# EAGLE board electrosteel2020_10_arrange6_synthboardsonly3 (EAGLE 9.6.2)
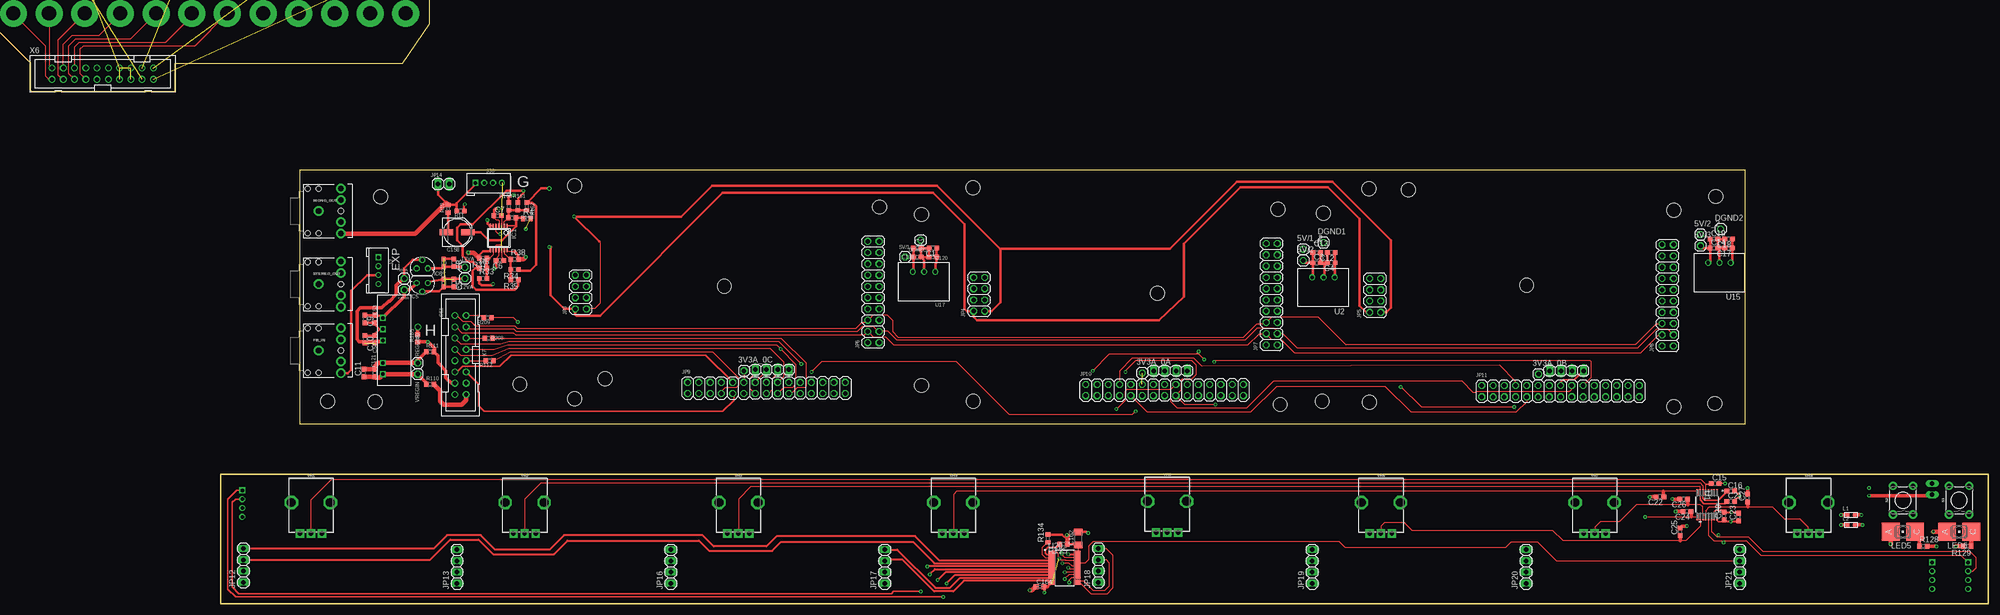
[diagram p2: board, top side]
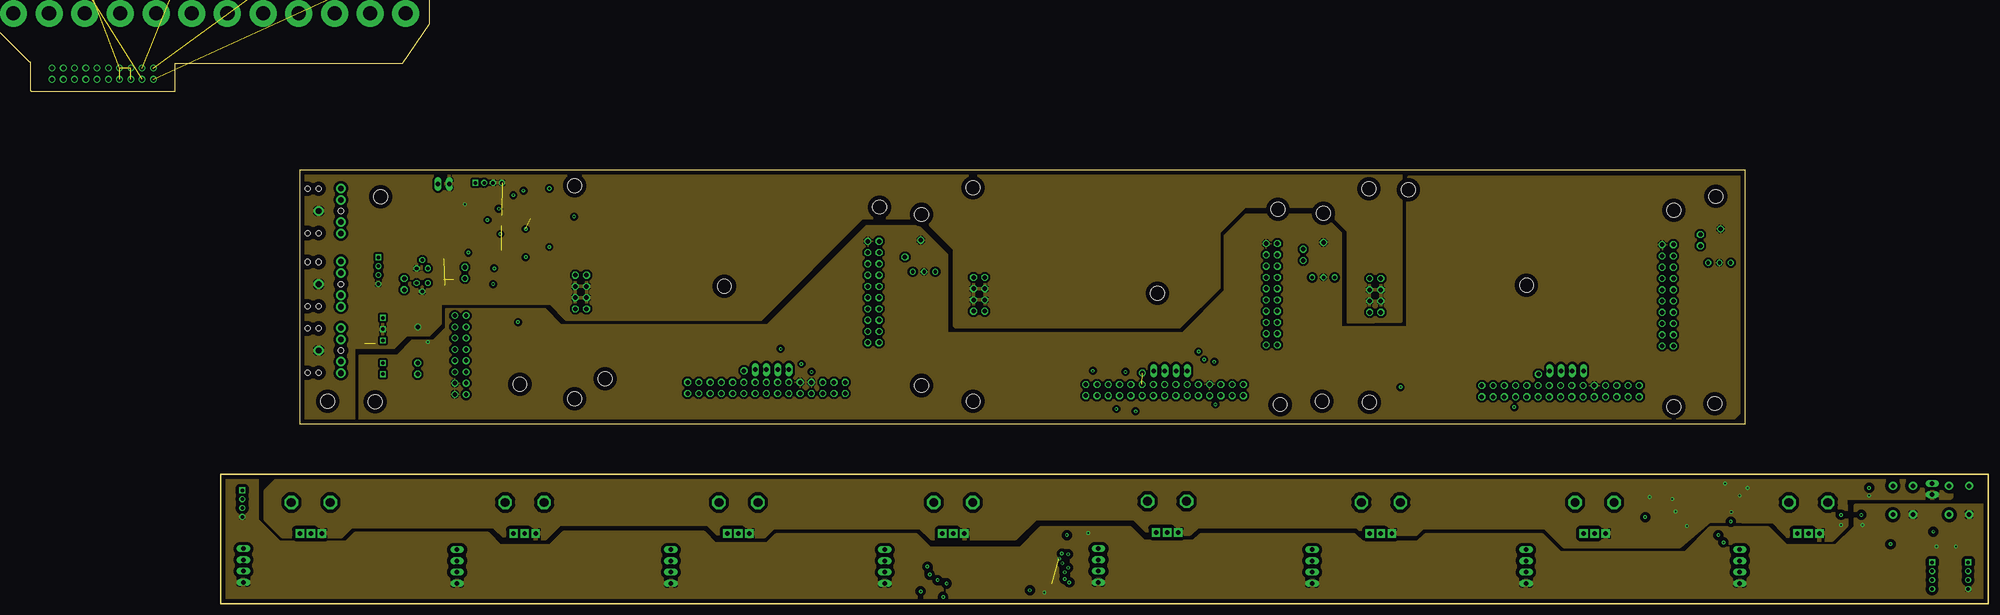
[diagram p3: board, inner layer Route2]
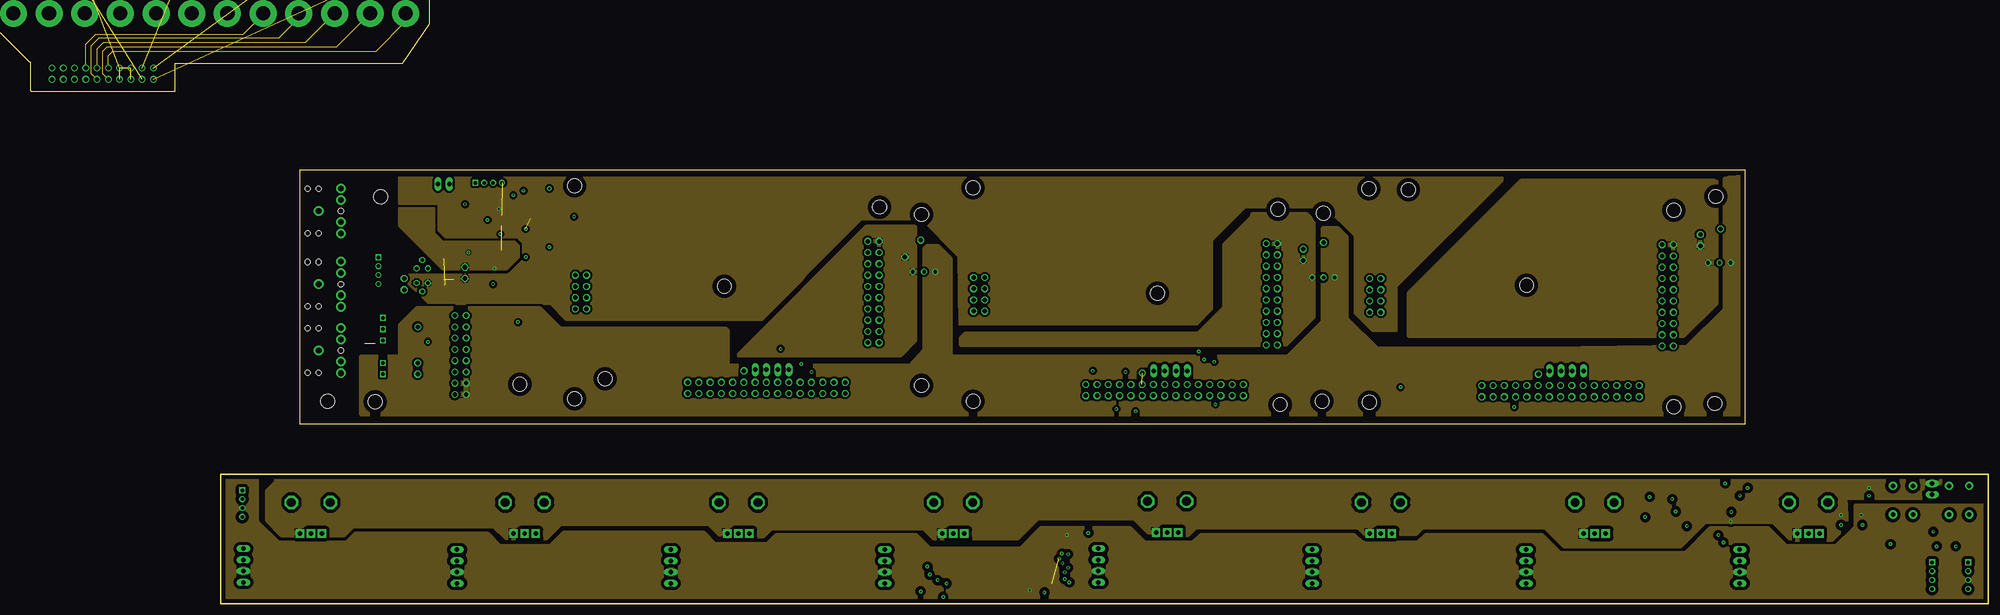
[diagram p4: board, inner layer Route15]
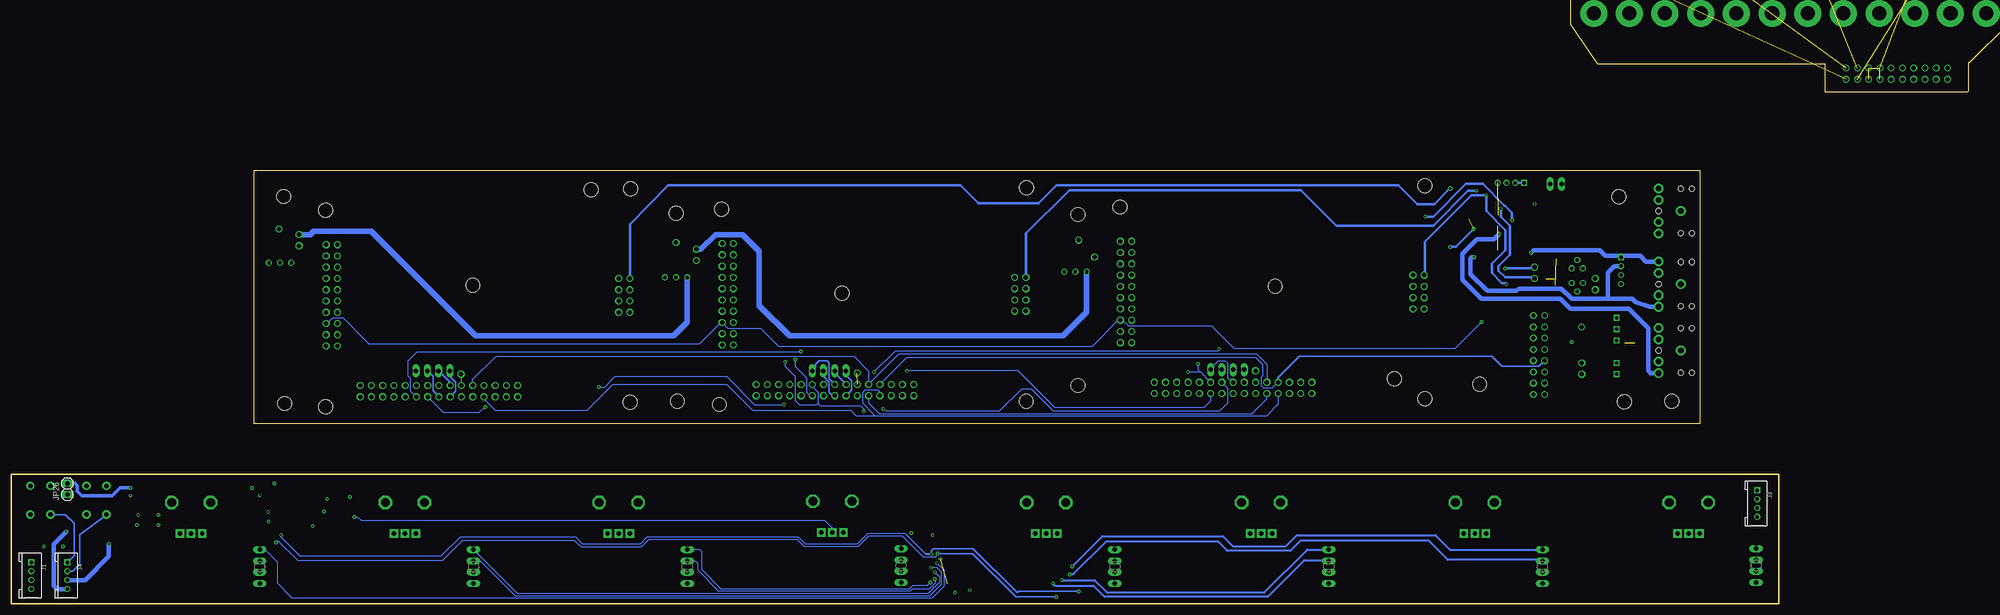
[diagram p5: board, bottom side, seen from below]

Size 399.03 x 97.79 mm. Coordinates in mm from the lower left corner, seen from the top.
Outline: 17.78,97.79 17.78,40.64 344.17,40.64 344.17,97.79 17.78,97.79
Outline: 0,0 0,29.21 399.03,29.21 399.03,0 0,0
Copper layers (1+2*15+16): Top 0.035mm / dielectric 0.5mm / Route2 0.035mm / dielectric 0.5mm / Route15 0.035mm / dielectric 0.5mm / Bottom 0.035mm
Design rules "default *": minimum track width 6mil, minimum drill 0.35mm, track to track 9mil, track to pad 9mil, pad to pad 9mil, via to via 9mil, smd to smd 9mil, copper to edge 40mil, drill to drill 6mil, minimum pad ring 10mil, minimum via ring 8mil, stop-mask expansion 4mil, vias tented up to drill 0mil, thermal gap 10mil
Holes 3.17 mm at 79.88,94.36 148.72,89.53 79.88,46.23 169.8,93.85 238.63,89.03 169.85,45.69 259.21,93.62 328.02,88.8 259.28,45.44 113.66,71.63 211.46,70.1 294.77,71.88 36.07,91.82 328.04,44.45 268.1,93.47 86.74,50.8 239.14,44.96 34.8,45.59 248.62,45.69 337.26,45.19 337.52,91.92 248.87,88.11 158.19,87.86 24.08,45.69 158.19,49.25 67.51,49.5
Milling: 15 lines

## Footprints (pad centres in the part's own frame; a part is rotated, then mirrored left to right if it is on the bottom)
1X01 = drill 1.016 octagon: 1 0,0
C0603 = smd 1.1 x 1: 1 -0.85,0; 2 0.85,0
PANASONIC_D = smd 3 x 1.4: + 2.4,0; - -2.4,0
C1206K = smd 1.5 x 2: 1 -1.5,0; 2 1.5,0
C0603K = smd 1.05 x 1.08: 1 -0.875,0; 2 0.875,0
AUDIO-JACK-KIT = drill 1.3 pad 2.184: RING 5,5.1; RSH 5,2.5; SLEEVE 0,0; TIP 5,-5.1; TSH 5,-2.5 | hole 1.2: 0,5; -2.5,5; -2.5,-5; 0,-5; 5,0
TSSOP14 = smd 0.305 x 0.991: 1 -1.905,-2.718; 2 -1.27,-2.718; 3 -0.635,-2.718; 4 0,-2.718; 5 0.635,-2.718; 6 1.27,-2.718; 7 1.905,-2.718; 8 1.905,2.718; 9 1.27,2.718; 10 0.635,2.718; 11 0,2.718; 12 -0.635,2.718; 13 -1.27,2.718; 14 -1.905,2.718
78LXX = drill 0.813 octagon: GND 0,1.905; IN 1.27,0; OUT -1.27,0
79LXX = drill 0.813 octagon: GND -1.27,0; IN 0,1.905; OUT 1.27,0
HW4-2.0 = drill 0.8 pad 1.27 square: 1 -3,0 | drill 0.8 pad 1.27: 2 -1,0; 3 1,0; 4 3,0
1X04 = drill 1.016 long: 1 -3.81,0; 2 -1.27,0; 3 1.27,0; 4 3.81,0
2X04 = drill 1.016 octagon: 1 -3.81,-1.27; 2 -3.81,1.27; 3 -1.27,-1.27; 4 -1.27,1.27; 5 1.27,-1.27; 6 1.27,1.27; 7 3.81,-1.27; 8 3.81,1.27
2X10 = drill 1.016 octagon: 1 -11.43,-1.27; 2 -11.43,1.27; 3 -8.89,-1.27; 4 -8.89,1.27; 5 -6.35,-1.27; 6 -6.35,1.27; 7 -3.81,-1.27; 8 -3.81,1.27; 9 -1.27,-1.27; 10 -1.27,1.27; 11 1.27,-1.27; 12 1.27,1.27; 13 3.81,-1.27; 14 3.81,1.27; 15 6.35,-1.27; 16 6.35,1.27; 17 8.89,-1.27; 18 8.89,1.27; 19 11.43,-1.27; 20 11.43,1.27
2X15 = drill 1.016 octagon: 1 -17.78,-1.27; 2 -17.78,1.27; 3 -15.24,-1.27; 4 -15.24,1.27; 5 -12.7,-1.27; 6 -12.7,1.27; 7 -10.16,-1.27; 8 -10.16,1.27; 9 -7.62,-1.27; 10 -7.62,1.27; 11 -5.08,-1.27; 12 -5.08,1.27; 13 -2.54,-1.27; 14 -2.54,1.27; 15 0,-1.27; 16 0,1.27; 17 2.54,-1.27; 18 2.54,1.27; 19 5.08,-1.27; 20 5.08,1.27; 21 7.62,-1.27; 22 7.62,1.27; 23 10.16,-1.27; 24 10.16,1.27; 25 12.7,-1.27; 26 12.7,1.27; 27 15.24,-1.27; 28 15.24,1.27; 29 17.78,-1.27; 30 17.78,1.27
1X02 = drill 1.016 long: 1 -1.27,0; 2 1.27,0
INDUCTOR_L0603 = smd 0.889 x 0.889: 1 -0.762,0; 2 0.762,0
P-LCC-2 = smd 4 x 4: A 0,2.75; C 0,-2.75
R0603 = smd 1 x 1.1: 1 -0.85,0; 2 0.85,0
TACTILE_SWITCH_PTH_6.0MM = drill 1.016 pad 1.88: 1 -3.251,2.261; 2 3.251,2.261; 3 -3.251,-2.261; 4 3.251,-2.261
21-0055H_16_MXM = smd 1.46 x 0.356: 1 -2.724,2.223; 2 -2.724,1.587; 3 -2.724,0.953; 4 -2.724,0.318; 5 -2.724,-0.318; 6 -2.724,-0.953; 7 -2.724,-1.587; 8 -2.724,-2.223; 9 2.724,-2.223; 10 2.724,-1.587; 11 2.724,-0.953; 12 2.724,-0.318; 13 2.724,0.318; 14 2.724,0.953; 15 2.724,1.587; 16 2.724,2.223
DC-DC_CONVERTER_78XX = drill 0.8: GND 0,0; VIN -2.54,0; VOUT 2.54,0
SOP65P640X120-24N = smd 1.57 x 0.41: 1 -2.87,3.575; 2 -2.87,2.925; 3 -2.87,2.275; 4 -2.87,1.625; 5 -2.87,0.975; 6 -2.87,0.325; 7 -2.87,-0.325; 8 -2.87,-0.975; 9 -2.87,-1.625; 10 -2.87,-2.275; 11 -2.87,-2.925; 12 -2.87,-3.575; 13 2.87,-3.575; 14 2.87,-2.925; 15 2.87,-2.275; 16 2.87,-1.625; 17 2.87,-0.975; 18 2.87,-0.325; 19 2.87,0.325; 20 2.87,0.975; 21 2.87,1.625; 22 2.87,2.275; 23 2.87,2.925; 24 2.87,3.575
CMR0512S3C = drill 0.8 square: P$1 -7.62,0; P$2 -5.08,0; P$3 0,0; P$4 2.54,0; P$5 5.08,0
POT-PTH-ALPS = drill 1 pad 1.88 square: P$1 7,-2.5; P$2 7,0; P$3 7,2.5 | drill 2 octagon: P$4 0,-4.4; P$5 0,4.4
PAK100/2500-20 = drill 1 pad 1.422: 1 -11.43,-1.27; 2 -11.43,1.27; 3 -8.89,-1.27; 4 -8.89,1.27; 5 -6.35,-1.27; 6 -6.35,1.27; 7 -3.81,-1.27; 8 -3.81,1.27; 9 -1.27,-1.27; 10 -1.27,1.27; 11 1.27,-1.27; 12 1.27,1.27; 13 3.81,-1.27; 14 3.81,1.27; 15 6.35,-1.27; 16 6.35,1.27; 17 8.89,-1.27; 18 8.89,1.27; 19 11.43,-1.27; 20 11.43,1.27
PAK100/2500-16 = drill 1 pad 1.422: 1 -8.89,-1.27; 2 -8.89,1.27; 3 -6.35,-1.27; 4 -6.35,1.27; 5 -3.81,-1.27; 6 -3.81,1.27; 7 -1.27,-1.27; 8 -1.27,1.27; 9 1.27,-1.27; 10 1.27,1.27; 11 3.81,-1.27; 12 3.81,1.27; 13 6.35,-1.27; 14 6.35,1.27; 15 8.89,-1.27; 16 8.89,1.27

## Placement (x,y rotation side)
3V3A_0A  PINHD-1X1  [1X01]  208.03,52.07 0 top
3V3A_0B  PINHD-1X1  [1X01]  297.43,51.82 0 top
3V3A_0C  PINHD-1X1  [1X01]  118.11,52.58 0 top
5V/1  PINHD-1X1  [1X01]  154.43,78.23 0 top
5V/1_2  PINHD-1X1  [1X01]  244.35,80.01 0 top
5V/2  PINHD-1X1  [1X01]  244.35,77.47 0 top
5V/2_2  PINHD-1X1  [1X01]  334.01,83.31 0 top
5V/3  PINHD-1X1  [1X01]  334.01,80.77 0 top
+12VA  PINHD-1X1  [1X01]  55.12,73.41 0 top
+15VA  PINHD-1X1  [1X01]  41.4,70.87 180 top
-12VA  PINHD-1X1  [1X01]  55.12,75.95 180 top
-15VA  PINHD-1X1  [1X01]  41.4,73.41 180 top
C1  .1uf  [C0603]  160.78,80.26 180 top
C2  .1uf  [C0603]  157.23,80.26 0 top
C3  .01uf  [C0603]  247.4,76.96 0 top
C4  .01uf  [C0603]  250.7,76.96 180 top
C5  .1uf  [C0603]  52.58,72.39 270 top
C6  .1uf  [C0603]  62.99,77.47 180 top
C7  .1uf  [C0603]  62.48,87.63 0 top
C8  .1uf  [C0603]  52.58,76.96 270 top
C9  .1uf  [C0603]  32.51,64.26 270 top
C10  .1uf  [C0603]  32.51,59.69 270 top
C11  .1uf  [C0603]  32.26,52.07 90 top
C12  .1uf  [C0603]  250.7,79.25 180 top
C13  .1uf  [C0603]  247.4,79.25 0 top
C14  .01uf  [C0603]  337.06,80.26 0 top
C15  .01uf  [C0603]  337.31,27.18 0 top
C16  .01uf  [C0603]  340.87,25.4 0 top
C17  .01uf  [C0603]  340.36,80.26 180 top
C18  .1uf  [C0603]  340.36,82.3 180 top
C19  .1uf  [C0603]  337.06,82.3 0 top
C20  .01uf  [C0603]  339.34,19.81 90 top
C21  .01uf  [C0603]  340.87,23.11 0 top
C22  .01uf  [C0603]  324.87,24.13 180 top
C23  .1uf  [C0603]  342.65,19.56 90 top
C24  .01uf  [C0603]  330.96,20.83 180 top
C25  .01uf  [C0603]  329.44,16.26 90 top
C26  .01uf  [C0603]  330.2,23.62 180 top
C27  .01uf  [C0603]  344.68,23.88 90 top
C51  .01uf  [C0603]  50.29,72.39 270 top
C52  .01uf  [C0603]  50.29,76.96 270 top
C53  .01uf  [C0603]  34.8,64.26 270 top
C54  .01uf  [C0603]  34.8,59.69 270 top
C119  .01uf  [C0603]  157.23,78.23 0 top
C120  .01uf  [C0603]  160.73,78.26 180 top
C121  .01uf  [C0603]  34.8,52.07 90 top
C158  22uf  [PANASONIC_D]  53.34,83.82 0 top
C162  1uf  [C1206K]  193.55,14.73 90 top
C164  .1uf  [C0603K]  184.91,3.81 0 top
DGND1  PINHD-1X1  [1X01]  248.92,81.53 0 top
DGND2  PINHD-1X1  [1X01]  338.58,84.58 0 top
DGND5  PINHD-1X1  [1X01]  157.99,82.04 180 top
FB_IN  AUDIO_JACK_3.5MM_KIT  [AUDIO-JACK-KIT]  22.1,57.15 0 top
IC1  OPA4344E  [TSSOP14]  62.74,82.55 180 top
IC5  [78LXX]  45.47,72.39 180 top
IC6  [79LXX]  45.47,75.69 0 top
J1  4P-2.0  [HW4-2.0]  394.46,6.35 270 bottom
J2  4P-2.0  [HW4-2.0]  35.56,75.18 270 top
J3  4P-2.0  [HW4-2.0]  4.83,22.61 270 bottom
J4  4P-2.0  [HW4-2.0]  386.33,6.35 270 bottom
J36  4P-2.0  [HW4-2.0]  60.45,95 0 top
JP1  PINHD-1X4  [1X04]  124.46,52.83 180 top
JP2  PINHD-1X4  [1X04]  214.38,52.58 180 top
JP3  PINHD-2X4  [2X04]  81.28,70.36 90 top
JP4  PINHD-2X4  [2X04]  171.2,69.85 90 top
JP5  PINHD-2X4  [2X04]  260.6,69.6 90 top
JP6  PINHD-2X10  [2X10]  147.32,70.36 90 top
JP7  PINHD-2X10  [2X10]  237.24,69.85 90 top
JP8  PINHD-2X10  [2X10]  326.64,69.6 90 top
JP9  [2X15]  123.16,48.72 0 top
JP10  [2X15]  213.06,48.23 0 top
JP11  [2X15]  302.44,47.98 0 top
JP12  PINHD-1X4  [1X04]  5.08,8.64 90 top
JP13  PINHD-1X4  [1X04]  53.34,8.38 90 top
JP14  PINHD-1X2  [1X02]  50.29,94.74 0 top
JP15  PINHD-1X4  [1X04]  303.78,52.58 180 top
JP16  PINHD-1X4  [1X04]  101.6,8.38 90 top
JP17  PINHD-1X4  [1X04]  149.86,8.38 90 top
JP18  PINHD-1X4  [1X04]  198.12,8.64 90 top
JP19  PINHD-1X4  [1X04]  246.38,8.38 90 top
JP20  PINHD-1X4  [1X04]  294.64,8.38 90 top
JP21  PINHD-1X4  [1X04]  342.9,8.38 90 top
JP22  PINHD-1X2  [1X02]  -30.73,140.46 90 top  (outside the outline)
JP23  PINHD-1X2  [1X02]  -10.41,140.46 90 top  (outside the outline)
JP24  PINHD-1X2  [1X02]  29.97,140.46 90 top  (outside the outline)
JP25  PINHD-1X2  [1X02]  9.65,140.46 90 top  (outside the outline)
JP26  PINHD-1X2  [1X02]  386.33,25.91 90 bottom
L1  [INDUCTOR_L0603]  368.05,20.07 0 top
L2  [INDUCTOR_L0603]  368.05,17.78 0 top
LED5  GREEN  [P-LCC-2]  379.73,16.26 90 top
LED6  RED  [P-LCC-2]  392.43,16.26 90 top
MONO_OUT  AUDIO_JACK_3.5MM_KIT  [AUDIO-JACK-KIT]  22.1,88.65 0 top
R4  0R  [R0603]  69.09,86.87 0 top
R5  7.2k  [R0603]  59.18,75.69 0 top
R10  560R  [R0603]  51.31,89.15 90 top
R11  47k  [R0603]  54.1,88.65 180 top
R33  10k  [R0603]  59.18,73.41 0 top
R34  10k  [R0603]  66.29,75.44 180 top
R35  7.2k  [R0603]  66.29,73.15 180 top
R37  10k  [R0603]  59.18,77.98 180 top
R38  10k  [R0603]  66.29,77.72 0 top
R110  0R  [R0603]  47.24,49.53 0 top
R111  0R  [R0603]  47.24,56.9 0 top
R112  33R  [R0603]  60.71,54.86 180 top
R125  1k  [R0603]  190.25,13.46 180 top
R128  4.7k  [R0603]  384.3,12.95 0 top
R129  560R  [R0603]  394.21,12.95 180 top
R134  1k  [R0603]  186.69,14.73 90 top
R159  1k  [R0603]  65.79,87.12 0 top
R160  1k  [R0603]  65.02,89.66 270 top
R161  1k  [R0603]  67.06,89.66 270 top
R162  1k  [R0603]  69.09,89.66 270 top
R185  0R  [R0603]  44.45,59.94 90 top
R208  33R  [R0603]  60.45,59.94 180 top
R209  33R  [R0603]  60.2,64.52 180 top
S1  MOMENTARY-SWITCH-SPST-PTH-6.0MM  [TACTILE_SWITCH_PTH_6.0MM]  392.43,23.37 90 top
S2  MOMENTARY-SWITCH-SPST-PTH-6.0MM  [TACTILE_SWITCH_PTH_6.0MM]  379.73,23.37 90 top
STEREO_OUT  AUDIO_JACK_3.5MM_KIT  [AUDIO-JACK-KIT]  22.1,72.14 0 top
U1  MAX11615EEE+  [21-0055H_16_MXM]  335.53,22.35 270 top
U2  R-78E5.0-1.0  [DC-DC_CONVERTER_78XX]  248.92,73.66 180 top
U15  R-78E5.0-1.0  [DC-DC_CONVERTER_78XX]  338.33,76.96 180 top
U17  R-78E5.0-1.0  [DC-DC_CONVERTER_78XX]  158.75,74.93 180 top
U20  TCA9548APWR  [SOP65P640X120-24N]  190.5,8.13 0 top
U$3  CMR0512S3C  [CMR0512S3C]  36.58,59.44 90 top
VR1  10k  [POT-PTH-ALPS]  20.32,22.86 270 top
VR2  10k  [POT-PTH-ALPS]  68.58,22.86 270 top
VR3  10k  [POT-PTH-ALPS]  116.84,22.86 270 top
VR4  10k  [POT-PTH-ALPS]  165.35,22.86 270 top
VR5  10k  [POT-PTH-ALPS]  213.61,23.11 270 top
VR6  10k  [POT-PTH-ALPS]  261.87,22.86 270 top
VR7  10k  [POT-PTH-ALPS]  310.13,22.86 270 top
VR8  10k  [POT-PTH-ALPS]  358.39,22.86 270 top
VREGGND  PINHD-1X1  [1X01]  44.45,54.36 180 top
VREGIN  PINHD-1X1  [1X01]  44.45,51.82 180 top
X6  2520-  [PAK100/2500-20]  -26.67,119.63 0 top  (outside the outline)
X7  2516-  [PAK100/2500-16]  54.1,56.13 90 top

## Tracks (layer width: path | path; a pad name or v marks a point on that pad's centre or on a via)
3V3D3  (via drill 0.35)
  Top 0.254: C162.1 193.55,11.88 U20.24
  Top 0.508: C162.1 193.32,13.46 R125.1 191.1,14.39 189.9,15.58 R134.2
  Top 0.813: L1.2 v370.33,20.07
  Top 1.016: R125.1 191.1,15.41 v191.01,15.49 | C164.1 183.9,3.81 183.13,3.05 v182.63,3.05
  pour Route15 (isolate 0.762): 0.25,1.27 0.25,29.02 7.87,28.96 8.13,28.7 8.13,18.54 12.95,13.72 28.45,13.72 30.48,15.75 60.2,15.75 62.99,12.95 74.42,12.95 77.47,16 108.97,16 111.51,13.46 123.44,13.46 125.48,15.49 156.97,15.49 160.02,12.45 180.59,12.45 185.17,17.02 205.23,17.02 208.53,13.72 219.46,13.72 221.23,15.49 255.78,15.49 257.56,13.72 270.26,13.72 272.03,15.49 298.2,15.49 302.26,11.43 330.71,11.43 336.3,17.02 349.25,17.02 353.31,12.95 364.74,12.95 369.06,17.27 369.06,22.1 397.76,22.1 397.76,1.27
+3.3V  (via drill 0.35)
  Top 0.254: U1.16 337.76,18.87 338.08,18.54 | 342.48,18.54 C23.1
  Top 0.305: 338.08,18.54 v340.87,18.54
  Top 0.406: 342.48,18.54 v340.87,18.54 339.43,18.54 339.43,18.87 C20.1
  Top 0.813: L1.1 v365.76,20.07
  Bottom 0.813: JP26.2 384.56,27.18 384.05,26.67 384.05,25.4 383.03,24.38 376.17,24.38 374.4,26.16 v372.11,26.16
  pour Route15 (isolate 0.762): 14.22,29.72 12.45,27.94 12.45,27.43 10.41,25.4 10.41,18.8 13.72,15.49 27.69,15.49 29.72,17.53 61.72,17.53 64.52,14.73 73.41,14.73 76.71,18.03 110.24,18.03 113.03,15.24 122.43,15.24 124.21,17.02 158.75,17.02 161.04,14.73 179.83,14.73 184.4,19.3 206.25,19.3 210.06,15.49 218.19,15.49 219.96,17.27 256.79,17.27 258.32,15.75 269.75,15.75 271.27,17.27 298.96,17.27 303.28,12.95 329.44,12.95 335.03,18.54 350.52,18.54 354.58,14.48 363.73,14.48 367.03,17.78 366.78,23.88 390.4,23.88 390.65,24.13 390.65,29.21 367.03,29.21 14.73,29.21
+5V/1
  Top 0.61: U17.VOUT 156.38,75.1 C119.1 C2.1
  Bottom 1.27: 5V/1_2.1 243.33,80.01 240.03,83.31 233.93,83.31 230.12,79.5 230.12,67.31 223.27,60.45 161.54,60.45 156.21,65.79 U17.VOUT
  pour Route15 (isolate 0.508): 156.72,85.09 156.72,59.44 153.42,56.13 116.84,56.13 145.8,85.09
+5V/2
  Top 0.61: C3.1 244.86,76.96 5V/2.1 | C13.1 C3.1 | C3.1 246.55,73.83 U2.VOUT
  Bottom 1.27: 5V/2_2.1 331.47,83.31 330.71,84.07 317.75,84.07 294.13,60.45 249.43,60.45 246.38,63.5 U2.VOUT
  pour Route15 (isolate 0.508): 246.63,86.36 246.63,64.77 240.28,58.42 167.13,58.42 167.13,59.94 168.15,60.96 220.73,60.96 226.57,66.8 226.57,81.03 232.92,87.38 232.92,87.88 245.11,87.88
+5V/3
  Top 0.61: C19.1 C14.1 | C14.1 336.21,77.38 U15.VOUT | C14.1 334.52,80.26 5V/3.1
  pour Route15 (isolate 0.508): 337.57,95.25 337.57,67.82 330.2,60.45 268.22,60.45 268.22,70.1 293.62,95.5 337.06,95.5 337.31,95.25
+9V  (via drill 0.35)  (1 unrouted)
  Top 0.254: C51.1 50.29,73.41 | 61.65,87.07 62.1,86.61 62.61,86.61 62.78,86.44 62.78,85.31 IC1.4
  Top 0.61: IC5.OUT 46.99,72.64 49.7,73.15 C51.1 | +12VA.1 50.29,73.41 | 61.65,87.07 61.63,87.08 C7.1 61.72,87.72 61.72,88.9 61.98,89.15 v62.74,89.15
  Bottom 0.61: +12VA.1 55.37,73.66 61.72,73.66 63.25,75.18 63.25,76.2 60.71,78.74 60.71,85.34 62.74,87.38 v62.74,89.15
  pour Route15 (isolate 0.508, rank 2): 40.13,74.42 64.77,74.42 68.07,77.72 68.07,81.03 66.55,82.55 50.55,82.55 49.02,84.07 49.02,90.17 40.13,90.17 40.13,96.27 289.39,96.27 289.39,95.5 265.51,71.63 265.51,61.47 259.93,61.47 255.86,65.53 255.86,83.06 249.51,89.41 231.22,89.41 223.86,82.04 223.86,66.55 220.3,62.99 166.62,62.82 166.43,78.43 158.24,86.61 144.53,86.61 141.48,83.57 132.2,74.42 131.06,72.9 122.17,64.01 77.98,64.01 74.42,67.56 46.99,67.56
+12V
  Top 0.61: U17.VIN 161.29,76.71 161.58,77 C120.1 161.58,80.21 C1.1 | C18.1 C17.1 341.21,77.3 U15.VIN | U2.VIN 251.55,73.75 C4.1 C12.1
  Top 1.016: R110.2 49.53,48.09 49.53,45.72 50.29,44.96 54.36,44.96 55.37,45.97 X7.1
  pour Route15 (isolate 0.508): 342.9,42.93 31.75,42.93 31.75,55.63 40.64,55.63 40.64,62.74 44.45,66.55 71.88,66.55 76.45,61.98 113.79,61.98 114.3,61.47 114.3,53.59 155.69,53.59 159,57.26 159,80.01 159.51,80.52 161.8,80.52 164.59,77.72 164.59,55.63 241.05,55.63 248.92,63.5 248.92,84.58 251.97,84.58 254,82.55 254,64.26 260.86,57.4 298.96,57.4 331.22,57.91 339.6,66.29 339.6,95.76 340.61,96.01 342.39,96.01 343.15,96.77 343.15,43.18
-9V  (via drill 0.35)
  Top 0.254: IC1.11 62.74,78.49 62.14,77.89 C6.2
  Top 0.61: -12VA.1 54.95,76.11 C8.2 C52.2 49.87,75.69 IC6.OUT | C6.2 62.14,75.86 61.98,75.69 v61.72,75.69
  Bottom 0.61: v61.72,75.69 55.37,75.69 -12VA.1
  pour Route15 (isolate 0.254): 48.26,89.41 40.13,89.41 40.13,85.34 50.04,75.44 64.52,75.44 67.31,78.23 67.31,80.77 66.29,81.79 50.04,81.79 48.26,83.57
A_IN  (via drill 0.35)  (1 unrouted)
  Top 0.508: v74.17,80.52 74.42,80.52 74.42,69.6 77.47,66.55 JP3.2 80.01,65.28 80.26,65.02 85.6,65.02 113.28,92.71 | JP4.2 169.93,64.77
  Top 0.61: JP4.2 168.4,66.04 167.89,66.55 167.89,85.6 160.78,92.71 113.28,92.71 | JP5.2 258.57,65.79 257.05,67.31 257.05,86.87 249.94,93.98 230.12,93.98 217.42,81.28 217.42,69.25 211.84,64.01 170.69,64.01 169.93,64.77
  Bottom 0.508: v74.17,80.52 72.9,80.52 v68.83,84.58
A_OUT1  (via drill 0.35)
  Top 0.254: 64.77,90.26 R160.1
  Top 0.406: 61.21,71.88 v61.47,72.14
  Top 0.61: R160.1 65.02,91.69 65.53,92.2 v66.04,92.2 | R33.1 58.33,72.39 58.84,71.88 61.21,71.88
  Bottom 0.406: 79.76,74.42 79.88,74.3 JP3.8
  Bottom 0.61: 79.88,74.3 79.88,81.66 69.34,92.2 v66.04,92.2 66.04,88.65 61.72,84.33 61.72,79.76 64.77,76.71 64.77,74.68 62.48,72.39 61.72,72.39 v61.47,72.14
A_OUT2  (via drill 0.35)
  Top 0.305: 58.17,75.95 58.17,75.69
  Top 0.406: v68.33,93.22 68.33,92.71 67.06,91.44 R161.1 | 58.17,75.69 R5.1
  Top 0.61: R35.1 67.14,71.72 66.29,70.87 57.66,70.87 56.9,71.63 56.9,75.18 57.4,75.69 58.17,75.69 | v68.33,93.22 64.52,93.22 56.9,85.6 54.1,85.6 53.34,84.84 53.34,82.04 54.61,80.77 54.61,78.49 55.88,77.22 56.9,77.22 58.17,75.95
  Bottom 0.61: JP4.8 169.93,83.57 160.13,93.36 107.84,93.36 99.82,85.34 77.98,85.34 70.1,93.22 v68.33,93.22
A_OUT3  (via drill 0.55)
  Top 0.406: 67.4,75.18 R34.1
  Top 0.61: v74.17,93.73 72.3,93.73 R162.1 70.27,90.51 71.12,89.66 71.12,76.45 69.85,75.18 67.4,75.18
  Bottom 0.61: v74.17,93.73 77.72,90.17 81.53,90.17 85.85,94.49 163.07,94.49 167.13,90.42 180.59,90.42 184.66,94.49 250.7,94.49 259.33,85.6 JP5.8
AGND1  (via drill 0.35)
  Top 0.254: U1.15 337.12,20.83 337.38,21.08
  Top 0.305: 337.38,21.08 338.92,21.08 C20.2 | C21.2 341.72,23.2 v342.9,24.38 342.14,25.15 341.97,25.15 C16.2 | C15.2 v339.6,27.18
  Top 0.406: C20.2 339.38,20.7 v341,20.7 342.35,20.7 C23.2
  Top 0.813: JP26.1 386.08,24.38 v372.11,24.38 | L2.1 v365.76,17.78 | C27.2 v344.68,26.16 | C26.2 v327.66,23.62 | C25.2 329.86,17.53 v330.96,17.53 | C24.2 v328.42,20.83 | C22.2 v322.58,24.13
  pour Route2 (isolate 0.762): 14.21,29.45 10.16,25.4 10.16,19.05 13.97,15.24 27.18,15.24 29.46,17.53 61.72,17.53 64.52,14.73 73.15,14.73 76.45,18.03 109.98,18.03 112.78,15.24 122.68,15.24 124.71,17.27 157.99,17.27 160.53,14.73 179.32,14.73 183.9,19.3 206.25,19.3 209.8,15.75 218.69,15.75 220.47,17.53 256.54,17.53 258.32,15.75 269.75,15.75 271.27,17.27 298.96,17.27 303.28,12.95 329.3,12.95 336.01,18.77 350.72,18.54 354.54,14.48 363.73,14.48 366.98,17.73 366.78,23.88 390.4,23.88 390.65,24.13 390.65,29.21 367.03,29.21 367.03,29.21
AGND3  (via drill 3.17 pad 6.35)  (12 unrouted)
  other vias: -37.59,144.53 -25.4,144.53 -4.57,144.53 15.24,144.53 35.81,144.27
AGND5  (via drill 0.35, 1)  (4 unrouted)
  Top 0.254: 34.3,63.25 34.54,63.25 34.67,63.37 34.8,63.5 C53.2 34.8,62.99 | 34.3,60.71 34.54,60.71 34.8,60.45 C54.1 34.8,60.96 | 50.54,71.89 C51.2 | 63.37,87.87 IC1.3 | C6.1 63.84,77.89 63.37,78.36 IC1.12 63.37,80.9 63.25,81.03 62.23,81.03 62.1,80.9 IC1.10
  Top 0.406: R11.1 54.95,90 v55.12,90.17 | 34.63,63.41 34.67,63.37
  Top 0.61: 35.81,61.98 U$3.P$4 | 34.8,62.99 35.81,61.98 | 34.8,60.96 35.81,61.98 | C9.2 34.63,63.41 | C10.1 34.38,60.54 34.54,60.71 | C5.2 C51.2 49.24,70.48 IC5.GND | C8.1 C52.1
  Top 0.813: R185.2 v44.45,62.48
  pour Route2 (isolate 0.508): 30.23,57.91 39.12,57.91 41.91,60.71 46.99,60.71 49.53,63.25 49.53,67.82 74.42,67.82 77.98,64.26 121.92,64.26 144.78,87.12 158.5,87.12 165.61,80.01 165.61,62.74 165.86,62.48 216.41,62.48 225.3,71.37 225.3,83.82 231.14,89.66 248.92,89.66 254.51,84.07 254.51,63.53 266.45,63.79 266.45,96.7 251.97,97.28 18.29,97.28 18.03,97.54 18.03,41.15 29.72,41.15 29.97,41.4 29.97,57.66
B_IN1  (via drill 0.35)
  Top 0.254: IC1.7 IC1.6 60.71,85.27 | 85.34,81.79 85.6,81.79 85.6,67.82 84.33,66.55 JP3.1 | 176.02,80.01 175.9,80.14
  Top 0.508: v60.2,86.61 60.2,85.78 60.71,85.27 | 110.87,94.36 103.89,87.38 v79.76,87.38 85.34,81.79
  Top 0.61: JP4.1 173.99,66.04 176.02,68.07 176.02,80.01 | 110.87,94.36 161.67,94.36 175.9,80.14 214.25,80.14 229.36,95.25 250.95,95.25 264.16,82.04 264.16,66.8 263.14,65.79 JP5.1
  Bottom 0.508: v60.2,86.61 60.2,88.3 61.76,89.86 61.92,89.86 66.8,94.74 70.61,94.74 77.98,87.38 v79.76,87.38
DGND4  (via drill 0.35)
  Top 0.61: C119.2 C2.2 C1.2 159.88,80.21 C120.2 159.86,78.23 C119.2 | C119.2 158.75,77.56 U17.GND | C14.2 C19.2 C18.2 C17.2 C14.2 | C14.2 338.33,79.84 U15.GND | C13.2 C3.2 249.17,76.96 | C12.2 C4.2 249.17,76.96 | 249.17,76.96 249.17,73.91 U2.GND
  Top 0.813: R185.1 46.82,59.09 48.26,57.66 48.26,57.06 R111.2 49.02,55.97 49.02,54.36 50.8,52.58 50.8,51.05 52.07,49.78 X7.4
  other vias: 46.74,59.11
  pour Route2 (isolate 0.508): 31.24,41.4 31.24,56.13 39.88,56.13 43.18,59.44 48.01,59.44 50.8,62.23 50.8,66.55 73.15,66.55 76.71,62.99 123.44,62.99 145.8,85.34 157.48,85.34 164.08,78.74 164.08,61.21 217.17,61.21 226.57,70.61 226.57,83.06 231.39,87.88 248.67,87.88 252.98,83.57 252.98,62.48 267.72,62.48 267.72,96.01 268.22,96.52 344.68,96.52 344.68,44.7 341.38,41.4
GND-ISO  (via drill 0.35)  (1 unrouted)
  Top 0.254: 194.33,16.23 C162.2 | U20.1 188.7,11.7 188.98,11.43 188.98,10.16 189.1,10.03 | 189.1,10.03 189.23,9.91 190.63,9.91 190.69,9.84 193.28,9.84 U20.21 | v189.23,10.16 189.1,10.03
  Top 0.305: U20.12 187.38,4.55 186.63,3.81
  Top 0.61: C164.2 v185.93,2.54 | C162.2 195.35,16.23 195.58,16 v195.83,16
  Top 0.813: 186.63,3.81 C164.2 | R128.2 v387.35,12.95 | L2.2 v370.59,17.78
  Top 1.016: R129.2 v391.67,12.95
  pour Route2 (isolate 0.762): 0.25,28.96 0.25,1.27 397.76,1.27 397.76,22.1 369.06,22.1 369.06,17.27 364.74,12.95 353.31,12.95 349.25,17.02 336.3,17.02 330.71,11.43 302.26,11.43 298.2,15.49 272.03,15.49 270.26,13.72 257.56,13.72 255.78,15.49 221.23,15.49 219.71,13.97 208.28,13.97 205.23,17.02 185.17,17.02 180.59,12.45 160.02,12.45 156.97,15.49 125.48,15.49 123.44,13.46 111.51,13.46 108.97,16 77.47,16 74.42,12.95 62.99,12.95 60.2,15.75 30.48,15.75 28.45,13.72 13.21,13.72 8.13,18.8 8.13,28.7 7.87,28.96
MASTERSCL  (via drill 0.35)
  Top 0.254: U20.22 190.51,10.4 189.74,11.18 v189.87,11.3 | 339.6,14.22 337.06,14.22 335.85,15.43 U1.13 | J1.1 392.94,10.87 347.77,10.87 344.42,14.22 339.85,14.22 339.6,14.22 | v339.22,13.84 339.6,14.22
  Top 0.305: v163.07,1.52 3.3,1.52 1.52,3.3 1.52,23.62 3.56,25.65 v4.78,25.65
  Bottom 0.254: v189.87,11.3 189.87,11.03 190.45,10.44 193.07,10.44 197.81,15.19 205.51,15.19 207.8,12.9 219.94,12.9 221.47,14.43 255.07,14.43 256.79,12.7 270.26,12.7 271.78,14.22 297.18,14.22 301.75,9.65 334.26,9.65 338.84,14.22 v339.22,13.84
  Bottom 0.305: v189.87,11.3 181.99,11.3 172.21,1.52 v163.07,1.52 | v4.78,25.65 J3.1
MASTERSDA  (via drill 0.35)
  Top 0.254: U1.14 336.55,19.56 336.55,16.26 337.82,14.99 338.07,14.99 | J1.2 395.48,7.35 396.25,8.12 396.24,10.42 394.97,11.68 348.23,11.68 344.93,14.99 338.07,14.99 | v338.07,15.49 338.07,14.99
  Top 0.305: v157.99,2.79 151.89,2.79 151.38,2.29 4.06,2.29 2.54,3.81 2.54,22.86 3.3,23.62 v4.81,23.62
  Top 0.406: U20.23 191.64,11.05 191.52,11.18 v191.26,11.18
  Bottom 0.254: 192.53,11.18 197.1,15.75 205.74,15.75 208.03,13.46 219.71,13.46 221.23,14.99 255.52,14.99 257.05,13.46 270,13.46 271.53,14.99 297.69,14.99 302.01,10.67 333.76,10.67 338.07,14.99 v338.07,15.49
  Bottom 0.305: v191.26,11.18 191.26,11.94 190.75,12.45 181.86,12.45 171.96,2.54 171.7,2.54 171.45,2.79 v157.99,2.79 | v4.81,23.62 J3.2
  Bottom 0.406: v191.26,11.18 192.53,11.18
MONO_OUTPUT
  Top 0.305: IC1.1 66.56,85.27 66.64,85.34
  Top 0.508: C158.+ 58.67,83.82 60.45,82.04 63.5,82.04 66.64,85.18 66.64,85.34 R159.2 67.98,87.12 R4.1
N$1
  Top 0.813: LED5.C 383.45,15.2 R128.1
N$3
  Top 0.254: U1.5 335.22,26.99 334.26,27.94 24.89,27.94 20.32,23.37 VR1.P$2
  Top 0.305: C15.1 336.27,26.99 335.22,26.99
N$4
  Top 0.254: U1.6 334.58,26.69 334.09,27.18 72.14,27.18 68.58,23.62 VR2.P$2
  Top 0.305: U1.6 334.58,23.84 335.03,23.39 338.1,23.39 340.02,25.31 C16.1
N$5
  Top 0.254: U1.7 333.95,26.42 119.63,26.42 116.84,23.62 VR3.P$2
  Top 0.305: U1.7 333.95,23.43 334.77,22.61 339.51,22.61 C21.1
N$6
  Top 0.254: U1.8 333.31,25.4 325.63,25.4 166.12,25.4 165.35,24.64 VR4.P$2
  Top 0.813: C22.1 325.63,24.22 325.63,25.4
N$7
  Bottom 0.305: S2.1 383.54,15.57 383.54,8.89 385.08,7.35 J4.2
N$8  (via drill 0.35)
  Top 0.254: U1.9 331.98,19.63 321.63,19.63 v321.56,19.56
  Top 0.813: C24.1 331.98,20.66 331.98,19.63
  Bottom 0.254: v321.56,19.56 320.8,19.56 320.04,18.8 215.39,18.8 213.61,17.02 VR5.P$2
N$9
  Top 0.254: U1.10 333.95,17.46 330.71,14.22 329.44,14.22 303.02,14.22 300.74,16.51 268.99,16.51 267.21,18.29 262.64,18.29 261.87,17.53 VR6.P$2
  Top 0.813: C25.1 329.44,14.22
N$10  (via drill 0.35)
  Top 1.016: LED5.A 376.98,13.42 v376.94,13.46
  Bottom 1.016: J4.3 382.25,5.35 376.94,10.67 v376.94,13.46
N$11
  Top 0.254: U1.11 334.52,19.69 334.52,21.84 334.01,22.35 331.22,22.35 319.53,22.35 315.72,18.54 311.4,18.54 310.13,17.27 VR7.P$2
  Top 0.813: C26.1 331.22,23.46 331.22,22.35
N$12
  Top 0.254: VR8.P$2 358.39,17.27 356.62,19.05 353.06,19.05 350.27,21.84 344.68,21.84 336.04,21.84 335.22,21.02 U1.12
  Top 0.813: C27.1 344.68,21.84
N$13  (via drill 0.35)
  Top 1.016: LED6.A v386.59,16.26
  Bottom 1.016: v386.59,16.26 389.38,13.46 389.38,4.06 388.62,3.3 386.38,3.3 J4.4
N$15
  Top 0.305: R125.2 188.63,12.7 186.69,12.7 186.18,12.19 186.18,11.43 186.56,11.05 U20.2
N$16
  Top 0.254: IC1.9 61.47,78.74 60.71,77.98
  Top 0.61: 60.71,77.98 R37.1 R5.2 R33.2
N$17
  Top 0.254: IC1.13 64.01,78.98 64.02,78.98 65.28,77.72 R38.1
  Top 0.61: R38.1 R34.2 R35.2
N$18  (via drill 0.35)
  Top 0.254: IC1.14 64.97,79.5 66.29,79.5
  Top 0.61: 66.29,79.5 67.14,78.65 R38.2
  Top 1.016: v68.83,78.23 68.33,77.72 R38.2
  Bottom 1.016: STEREO_OUT.TIP 29.13,67.04 32.24,68.07 33.01,68.84 38.61,68.81 | 38.61,68.81 46.72,68.81 49.02,71.12 58.67,71.12 59.18,70.61 65.79,70.61 69.6,74.42 69.6,77.98 69.34,78.23 v68.83,78.23 | J2.2 35.58,76.2 37.08,76.2 38.61,74.68 38.61,68.81
N$19  (via drill 0.35)
  Top 0.254: IC1.8 60.5,79.5
  Top 0.61: R37.2 58.33,78.65 59.18,79.5 60.5,79.5
  Top 1.016: v55.88,79.25 57.06,79.25 R37.2
  Bottom 1.016: STEREO_OUT.RING 29.97,77.24 31.24,78.51 35.88,78.51 | 35.88,78.51 39.14,78.51 40.39,79.76 55.37,79.76 v55.88,79.25 | J2.1 35.88,78.51
N$20  (1 unrouted)
N$21  (via drill 0.35)
  Top 0.254: v63.12,83.46 62.64,83.46 62.1,84 IC1.5
  Top 0.61: J2.3 35.54,74.17 33.02,74.17 29.46,70.61 29.46,52.83 28.68,52.05 FB_IN.TIP
  Bottom 1.016: FB_IN.TIP 28.94,52.05 29.46,52.58 29.46,62.23 33.78,66.55 46.99,66.55 49.28,68.83 67.06,68.83 71.37,73.15 71.37,78.99 68.07,82.3 64.26,82.3 63.12,83.44 v63.12,83.46
N$22  (1 unrouted)
N$23  (1 unrouted)
N$24  (1 unrouted)
N$27
  Top 0.254: 65.02,87.21 R159.1 64.01,86.19 IC1.2
  Top 0.61: R162.2 R161.2 R160.2 65.02,87.21
N$105
  Top 0.254: C121.2 34.8,53.59 34.67,53.47
  Top 0.813: R111.1 44.45,54.95 VREGGND.1
  Top 1.016: VREGGND.1 U$3.P$2 35.56,54.36 34.8,53.59 | C11.2 34.63,52.92 34.67,53.47
N$106
  Top 0.254: C121.1 34.8,51.31
  Top 0.61: 34.3,51.31 34.8,51.31
  Top 0.813: VREGIN.1 46.39,49.87 R110.1
  Top 1.016: VREGIN.1 U$3.P$1 35.81,51.05 34.96,51.05 C121.1 C11.1
N$145
  Bottom 0.305: S1.1 386.79,20.09 384.81,18.2 384.81,10.87 J4.1
N$174
  Top 0.254: U20.3 186.19,10.4 185.42,11.18 185.42,12.61 R134.1
N$196
  Top 1.016: LED6.C 395.18,13.08 R129.1
N$249
  Top 0.61: R10.1 51.31,84.19 C158.-
N$265
  Top 0.406: 53,90 53.09,89.92 R11.2
  Top 0.61: 53,90 R10.2 49.02,92.29 JP14.1 | J36.1 57.45,94.54 53.25,90.34 R11.2
  Top 1.016: R10.2 50.84,90.47 43.92,83.55 MONO_OUT.TIP
  Bottom 0.61: J36.1 J36.2
N$284
  Top 0.254: R209.2 59.26,64.6 59.09,64.6 58.67,65.02 X7.15
N$293
  Top 0.254: X7.11 R208.2
N$294
  Top 0.254: X7.7 R112.2
N$298
  Top 0.254: JP1.4 120.65,52.07 119.38,50.8 119.38,48.69 JP9.13
  Top 0.305: JP9.13 120.65,47.42
N$299
  Top 0.254: 3V3A_0C.1 118.11,50.01 JP9.12
N$300
  Top 0.254: JP1.2 125.73,52.07 124.46,50.8 124.46,48.26 123.65,47.45 JP9.15
N$309  (1 unrouted)
N$310
  Bottom 0.254: 3V3A_0B.1 297.43,49.33 JP11.12
PA0-2
  Bottom 0.305: JP2.4 210.57,51.56 209.3,50.29 209.3,48.18 JP10.13
PA0-3
  Bottom 0.305: JP15.4 299.97,51.31 298.7,50.04 298.7,47.9 JP11.13
PA1-2
  Bottom 0.305: JP2.3 213.11,52.09 JP10.14
PA1-3
  Bottom 0.305: JP11.14 299.9,49.96 JP15.3
PA1_1
  Top 0.254: JP1.3 123.19,52.55 JP9.14
PA2-2
  Bottom 0.305: JP2.2 215.65,51.31 214.38,50.04 214.38,47.75 213.59,46.97 JP10.15
PA2-3
  Bottom 0.305: JP11.15 303.78,48.06 303.78,51.31 JP15.2
PA3-2
  Bottom 0.305: JP2.1 217.42,53.34 217.42,54.1 216.66,54.86 214.88,54.86 214.38,54.36 214.38,50.83 JP10.16
PA3-3
  Top 0.305: JP15.1 305.56,50.55 303.02,50.55 302.44,49.96 JP11.16
PA3_1
  Bottom 0.254: JP1.1 128.27,53.09 126.49,54.86 124.97,54.86 124.46,54.36 124.46,51.05 123.44,50.04 123.19,50.04 JP9.16
REG+12V
  Top 0.254: 34.79,65.02 C53.1 34.8,65.02
  Top 0.61: 34.8,65.02 36.07,65.02 U$3.P$5 | C53.1 C9.1
  Top 0.813: IC5.IN 42.67,70.87 +15VA.1 41.4,69.34 U$3.P$5
REG-12V  (1 unrouted)
  Top 0.254: U$3.P$3 34.8,59.44 C54.2 34.79,59.44
  Top 0.61: IC6.IN 43.31,77.6 41.4,75.69 -15VA.1
  Top 0.813: -15VA.1 41.15,73.41 39.62,71.88 39.62,69.85 38.1,68.33 37.85,68.33 36.32,66.8 31.5,66.8 30.73,66.04 30.73,59.69 31.25,59.18 36.32,59.18 U$3.P$3
SC0
  Top 0.406: JP12.3 47.24,9.91 51.82,14.48 58.17,14.48 61.47,11.18 75.18,11.18 78.23,14.22 107.95,14.22 110.24,11.94 124.46,11.94 126.49,13.97 156.21,13.97 161.06,9.12 186.69,9.12 186.7,9.12 187.62,9.12 U20.5
SC1  (via drill 0.35)
  Top 0.406: v160.02,6.6 161.22,7.8 U20.7
  Bottom 0.406: JP13.3 53.59,9.91 74.68,9.91 78.99,14.22 107.95,14.22 110.24,11.94 124.46,11.94 126.49,13.97 151.89,13.97 159.26,6.6 v160.02,6.6
SC2  (via drill 0.35)
  Top 0.406: v163.83,4.57 165.76,6.5 U20.9
  Bottom 0.406: JP16.3 107.19,9.65 115.32,1.52 152.15,1.52 154.69,4.06 163.32,4.06 v163.83,4.57
SC3
  Top 0.406: U20.11 167.76,5.2 165.35,2.79 161.04,2.79 153.92,9.91 150.11,9.91 JP17.3
SC4
  Top 0.254: U20.14 194.7,5.2 196.85,3.05 199.64,3.05 200.66,4.06 200.66,9.14 199.9,9.91 JP18.3
SC5  (via drill 0.35)
  Top 0.254: U20.16 191.42,6.5 v190.5,5.59
  Bottom 0.254: v190.5,5.59 190.5,4.57 191.77,3.3 195.66,3.3 196.14,2.82 196.32,2.82 196.34,2.79 239.27,2.79 244.09,7.62 244.09,9.14 244.6,9.65 JP19.3
SC6  (via drill 0.35)
  Top 0.254: v191.26,8.13 191.52,7.87 193.3,7.87 U20.18
  Bottom 0.254: v191.26,8.13 189.99,8.13 189,7.14 189,4.37 191.6,1.78 285.24,1.78 293.12,9.65 JP20.3
SC7
  Top 0.254: JP21.3 301.5,9.65 297.18,13.97 291.34,13.97 290.07,12.7 253.75,12.7 252.48,13.97 196.85,13.97 195.83,12.95 195.83,9.91 195.03,9.1 U20.20
SD0
  Top 0.406: U20.4 162.21,9.75 156.72,15.24 125.48,15.24 123.19,12.95 111.25,12.95 108.71,15.49 77.47,15.49 74.17,12.19 61.98,12.19 58.67,15.49 51.05,15.49 48.01,12.45 JP12.4
SD1  (via drill 0.35)
  Top 0.406: v159.51,8.38 159.58,8.45 U20.6
  Bottom 0.406: v159.51,8.38 152.65,15.24 125.48,15.24 123.19,12.95 111.25,12.95 108.71,15.49 77.47,15.49 74.17,12.19 JP13.4
SD2  (via drill 0.35)
  Top 0.406: U20.8 163.62,7.15 v161.8,5.33
  Bottom 0.406: v161.8,5.33 154.43,5.33 151.64,2.54 116.08,2.54 106.43,12.19 JP16.4
SD3
  Top 0.406: JP17.4 152.65,12.19 161.29,3.56 164.59,3.56 166.89,5.85 U20.10
SD4
  Top 0.254: U20.13 194.13,4.55 196.4,2.29 200.15,2.29 201.42,3.56 201.42,10.92 199.9,12.45 JP18.4
SD5  (via drill 0.35)
  Top 0.254: U20.15 192.02,5.84 191.52,5.33 v191.52,4.83
  Bottom 0.254: v191.52,4.83 192.28,4.06 195.58,4.06 196.34,3.3 238.76,3.3 243.08,7.62 243.08,11.68 243.59,12.19 JP19.4
SD6  (via drill 0.35)
  Top 0.254: U20.17 190.54,7.15 v190.5,7.11
  Bottom 0.254: v190.5,7.11 189.48,6.1 189.48,4.83 192.02,2.29 284.73,2.29 JP20.4
SD7  (via drill 0.35)
  Top 0.254: U20.19 192.21,8.45 191.52,9.14 v189.99,9.14
  Bottom 0.254: v189.99,9.14 188.47,7.62 188.47,3.97 191.14,1.29 335.56,1.29 338.84,4.57 338.84,9.4 341.63,12.19 JP21.4
SPI1_CS  (via drill 0.35)
  Top 0.254: X7.9 61.72,57.4 64.77,58.42 125.48,58.42 v126.36,57.53 129.79,54.1 129.79,51.05 129.54,50.8 129.54,49.28 129.03,48.77 127.02,48.77 JP9.17 | v204.22,52.32 204.22,52.58 206.5,54.86 219.2,54.86 220.22,53.85 220.22,51.82 219.1,50.7 217.72,50.7 217.65,50.77 217.14,50.77 216.92,50.55 216.92,48.26 216.89,48.26 JP10.17 217.6,44.96 v224.54,44.96 | v292,44.37 271.1,44.37 266.45,49.02 v266.32,48.9
  Bottom 0.254: v204.22,52.32 199.39,57.15 126.49,57.15 126.24,57.4 v126.36,57.53 | JP11.17 301.45,43.18 293.37,43.18 292.18,44.37 v292,44.37 | v266.32,48.9 265.05,48.9 262.64,51.31 237.49,51.31 231.14,44.96 v224.54,44.96
SPI1_MISO  (via drill 0.35)
  Top 0.254: R208.1 126.49,59.94 132.08,54.36 132.08,49.02 131.83,48.77 130.05,48.77 128.73,47.45 JP9.19 | v196.85,52.58 200.66,56.39 220.22,56.39 | 220.22,56.39 220.73,56.39 v222,55.12 | v220.73,56.9 220.22,56.39
  Bottom 0.254: JP9.19 128.25,45.74 129.79,44.2 163.32,44.2 171.7,52.58 v196.85,52.58 | v222,55.12 222,53.59 219.46,51.05 219.46,47.75 218.67,46.97 JP10.19 | JP11.19 308.81,48.01 308.86,48.01 308.86,50.8 309.37,51.31 309.37,54.86 307.34,56.9 v220.73,56.9
SPI1_MOSI  (via drill 0.35)
  Top 0.254: X7.12 54.1,58.67 63.14,58.67 65,59.23 125.93,59.23 v131.06,54.1 | v206.5,43.43 205.74,42.67 178.05,42.67 166.12,54.61 135.64,54.61 v133.35,52.32 | JP11.20 309.37,51.1 309.37,54.61 309.12,54.86 224.54,54.86 v224.28,54.61
  Bottom 0.254: v131.06,54.1 131.06,52.83 130.56,52.32 | JP9.20 128.25,50.01 130.56,52.32 | JP10.20 218.14,48.97 216.92,47.75 216.92,45.21 | 216.92,45.21 216.41,44.7 207.26,44.7 206.5,43.94 v206.5,43.43 | v133.35,52.32 130.56,52.32 | v224.28,54.61 224.28,53.59 222,51.31 222,45.97 220.98,44.96 217.17,44.96 216.92,45.21
SPI1_SCK  (via drill 0.35)
  Top 0.254: X7.10 54.1,56.13 61.21,56.13 65.02,57.66 123.95,57.66 127,54.61 127,51.25 125.74,49.99 JP9.18 | v202.18,43.94 204.22,45.97 204.22,48.01 204.47,48.26 214.38,48.26 215.59,49.48 JP10.18 214.38,48.28 214.38,45.72 215.9,44.2 231.65,44.2 237.74,50.29 280.16,50.29 282.7,47.75 283.21,47.75 283.46,48.01 304.55,48.01 304.98,48.44 JP11.18
  Bottom 0.254: JP9.18 124.48,48.77 124.46,48.77 124.46,45.21 126.24,43.43 163.73,43.43 168.72,48.42 170.98,48.42 175.97,43.43 201.42,43.43 201.93,43.94 v202.18,43.94
SPI2_CS
  Top 0.254: JP8.3 326.64,61.98 324.1,61.98 319.79,57.66 243.08,57.66 239.78,60.96 JP7.3 238.51,61.47 237.74,62.23 233.93,62.23 231.14,59.44 152.65,59.44 150.62,61.47 JP6.3 148.34,61.47 147.32,62.48 144.78,62.48 143.64,61.34 66.83,61.34 66.19,61.98 55.88,61.98 X7.13
SPI2_MISO  (via drill 0.35)
  Top 0.254: R209.1 66.12,64.52 v67.08,63.55
  Bottom 0.254: JP8.5 327.66,63.25 326.39,64.52 324.1,64.52 318.26,58.67 243.59,58.67 238.76,63.5 JP7.5 237.24,62.23 229.87,62.23 225.81,58.17 154.94,58.17 149.1,64.01 JP6.5 148.08,64.01 146.81,62.74 128.02,62.74 122.94,57.66 72.97,57.66 v67.08,63.55
SPI2_MOSI
  Top 0.254: X7.16 53.34,65.02 54.61,63.75 56.39,63.75 57.4,62.74 66.32,62.74 66.93,62.13 143.41,62.13 144.78,63.5 145.54,63.5 JP6.6 147.32,65.28 150.37,65.28 151.64,64.01 151.64,61.47 152.91,60.2 230.89,60.2 233.93,63.25 235.71,63.25 JP7.6 237.24,64.77 247.65,64.77 254,58.42 319.28,58.42 324.1,63.25 JP8.6
SPI2_SCK
  Top 0.254: X7.14 53.09,62.48 54.36,61.21 66.04,61.21 66.55,60.71 145.29,60.71 JP6.4 | 145.8,61.21 JP6.4 | JP6.4 147.32,60.2 150.11,60.2 151.89,58.42 231.9,58.42 234.44,60.96 JP7.4 236.98,59.94 236.98,59.69 239.27,59.69 242.32,56.64 320.55,56.64 324.61,60.71 JP8.4
SPI5_CS
  Top 0.254: JP11.9 294.82,45.64 292.35,43.18 268.73,43.18 262.89,49.02 238.25,49.02 232.41,43.18 209.22,43.18 JP10.9
  Top 0.305: X7.5 58.17,49.53 58.17,44.7 59.44,43.43 113.28,43.43 115.82,45.97 115.82,47.17 JP9.9
  Bottom 0.254: JP10.9 205.44,45.41 202.95,42.93 118.87,42.93 115.54,46.25 JP9.9
SPI5_MISO
  Top 0.254: R112.1 65.28,56.9 111,56.9 116.84,51.05 116.84,49.28 116.33,48.77 113.79,48.77 113,47.98 JP9.7
  Bottom 0.254: JP9.7 113,44.98 115.68,42.3 203.96,42.3 | 203.96,42.3 208.17,42.3 209.55,43.69 231.65,43.69 237.49,49.53 263.14,49.53 268.99,43.69 289.81,43.69 292.28,46.15 JP11.7 | JP10.7 202.9,47.7 203.45,48.26 206.25,48.26 206.76,47.75 206.76,45.21 204.34,42.8 204.34,42.68 203.96,42.3
SPI5_MOSI
  Top 0.254: JP11.8 292.28,50.27 288.69,53.86 221.53,53.55 219.71,55.37 205.74,55.37 202.9,52.53 JP10.8
  Bottom 0.254: JP10.8 196.77,55.63 118.11,55.63 116.59,54.1 116.59,51.31 116.84,51.05 116.84,49.28 116.33,48.77 114.27,48.77 113.03,50.01
  Bottom 0.305: X7.8 54.13,53.56 62.45,53.56 64.77,55.88 108.2,55.88 113.03,51.05 113.03,50.01 JP9.8
SPI5_SCK
  Top 0.305: X7.6 53.36,52.32 54.6,53.56 62.96,53.56 65.53,56.13 109.47,56.13 115.54,50.06 JP9.10
  Bottom 0.254: JP9.10 115.54,54.08 117.86,56.39 198.55,56.39 JP10.10 205.44,52.53 208.79,55.88 289.56,55.88 294.82,50.62 JP11.10
TOUCH1  (via drill 3.17 pad 6.1)
  Top 0.203: -39.62,125.98 -39.62,119.13 -38.86,118.36 X6.1
  Top 0.254: -46.85,133.21 -39.62,125.98
  Top 0.508: -46.85,133.21 v-46.85,133.25
TOUCH2  (via drill 3.17 pad 6.1)
  Top 0.254: v-38.79,133.25 -38.79,121.59 X6.2
TOUCH3  (via drill 3.17 pad 6.1)
  Top 0.254: v-30.73,133.25 -36.83,127.16 -36.83,119.38 -35.81,118.36 X6.3
TOUCH4  (via drill 3.17 pad 6.1)
  Top 0.254: X6.4 -35.56,126.24 -33.53,128.27 -27.43,128.27 -22.68,133.02 v-22.68,133.25
TOUCH5  (via drill 3.17 pad 6.1)
  Top 0.254: X6.5 -34.29,119.63 -34.29,125.98 -32.77,127.51 -20.37,127.51 v-14.62,133.25
TOUCH6  (via drill 3.17 pad 6.1)
  Top 0.254: X6.6 -33.02,125.73 -32,126.75 -12.45,126.75 -6.57,132.62 v-6.57,133.25
TOUCH7  (via drill 3.17 pad 6.1)
  Top 0.254: X6.7 -31.75,119.63 -31.75,125.22 -30.99,125.98 -5.78,125.98 v1.49,133.25
TOUCH8  (via drill 3.17 pad 6.1)
  Route15 0.254: X6.8 -30.48,126.24 -28.19,128.52 5.08,128.52 9.54,132.99 v9.54,133.25
TOUCH9  (via drill 3.17 pad 6.1)
  Route15 0.254: X6.9 -29.21,119.63 -29.21,125.98 -27.43,127.76 13.21,127.76 17.6,132.15 v17.6,133.25
TOUCH10  (via drill 3.17 pad 6.1)
  Route15 0.254: X6.10 -27.94,125.22 -26.42,126.75 19.15,126.75 v25.65,133.25
TOUCH11  (via drill 3.17 pad 6.1)
  Route15 0.254: X6.11 -26.67,119.63 -26.67,124.71 -25.65,125.73 26.19,125.73 v33.71,133.25
TOUCH12  (via drill 3.17 pad 6.1)
  Route15 0.254: X6.12 -25.4,123.7 -24.38,124.71 35.05,124.71 41.77,131.43 v41.77,133.25

## Text on the board
tPlace: G | EXP | H
Patch_BOT: Lout | Rout | DGND | 5Vin | Lout | Rout | 5Vin | Lout | Rout | DGND | DGND | 5Vin | I2C4 | PD13 | PC6 | SDA | PC6 | PD13 | PD13 | SDA | PC6 | SCL | PD12 | D11 | SCL | D11 | SCL | PD12 | PD12 | D11 | Lin | Rin | Lin | Rin | Lin | MOSI | PB15 | PB14 | MISO | MOSI | PB15 | PB14 | Rin | MOSI | PB14 | MISO | PB15 | SCLK | PB13 | PB12 | CS | SCLK | PB13 | PB12 | SCLK | PB13 | PB12 | CS | 3v3a | PG10 | 3v3D | DGND | 3v3a | PG10 | 3v3D | DGND | 3v3a | PG10 | 3v3D | DGND | PA1 | PA3 | PA5 | PA7 | PC5 | PB1 | PD7 | SCL | PA3 | PA5 | PA7 | PC5 | PB1 | PD7 | SCL | PA3 | PA5 | PC5 | PA1 | PA1 | PA7 | PB1 | PD7 | SCL | AGND | PA4 | PA6 | PC4 | PB0 | SDA | PA0 | PA2 | PG9 | PG12 | AGND | PA0 | PA2 | PA4 | PA6 | PC4 | PB0 | PG9 | PG12 | SDA | AGND | PA0 | PA2 | PA4 | PA6 | PC4 | PB0 | PG9 | PG12 | SDA